# EAGLE design MCS8749R9 (EAGLE 4.16)
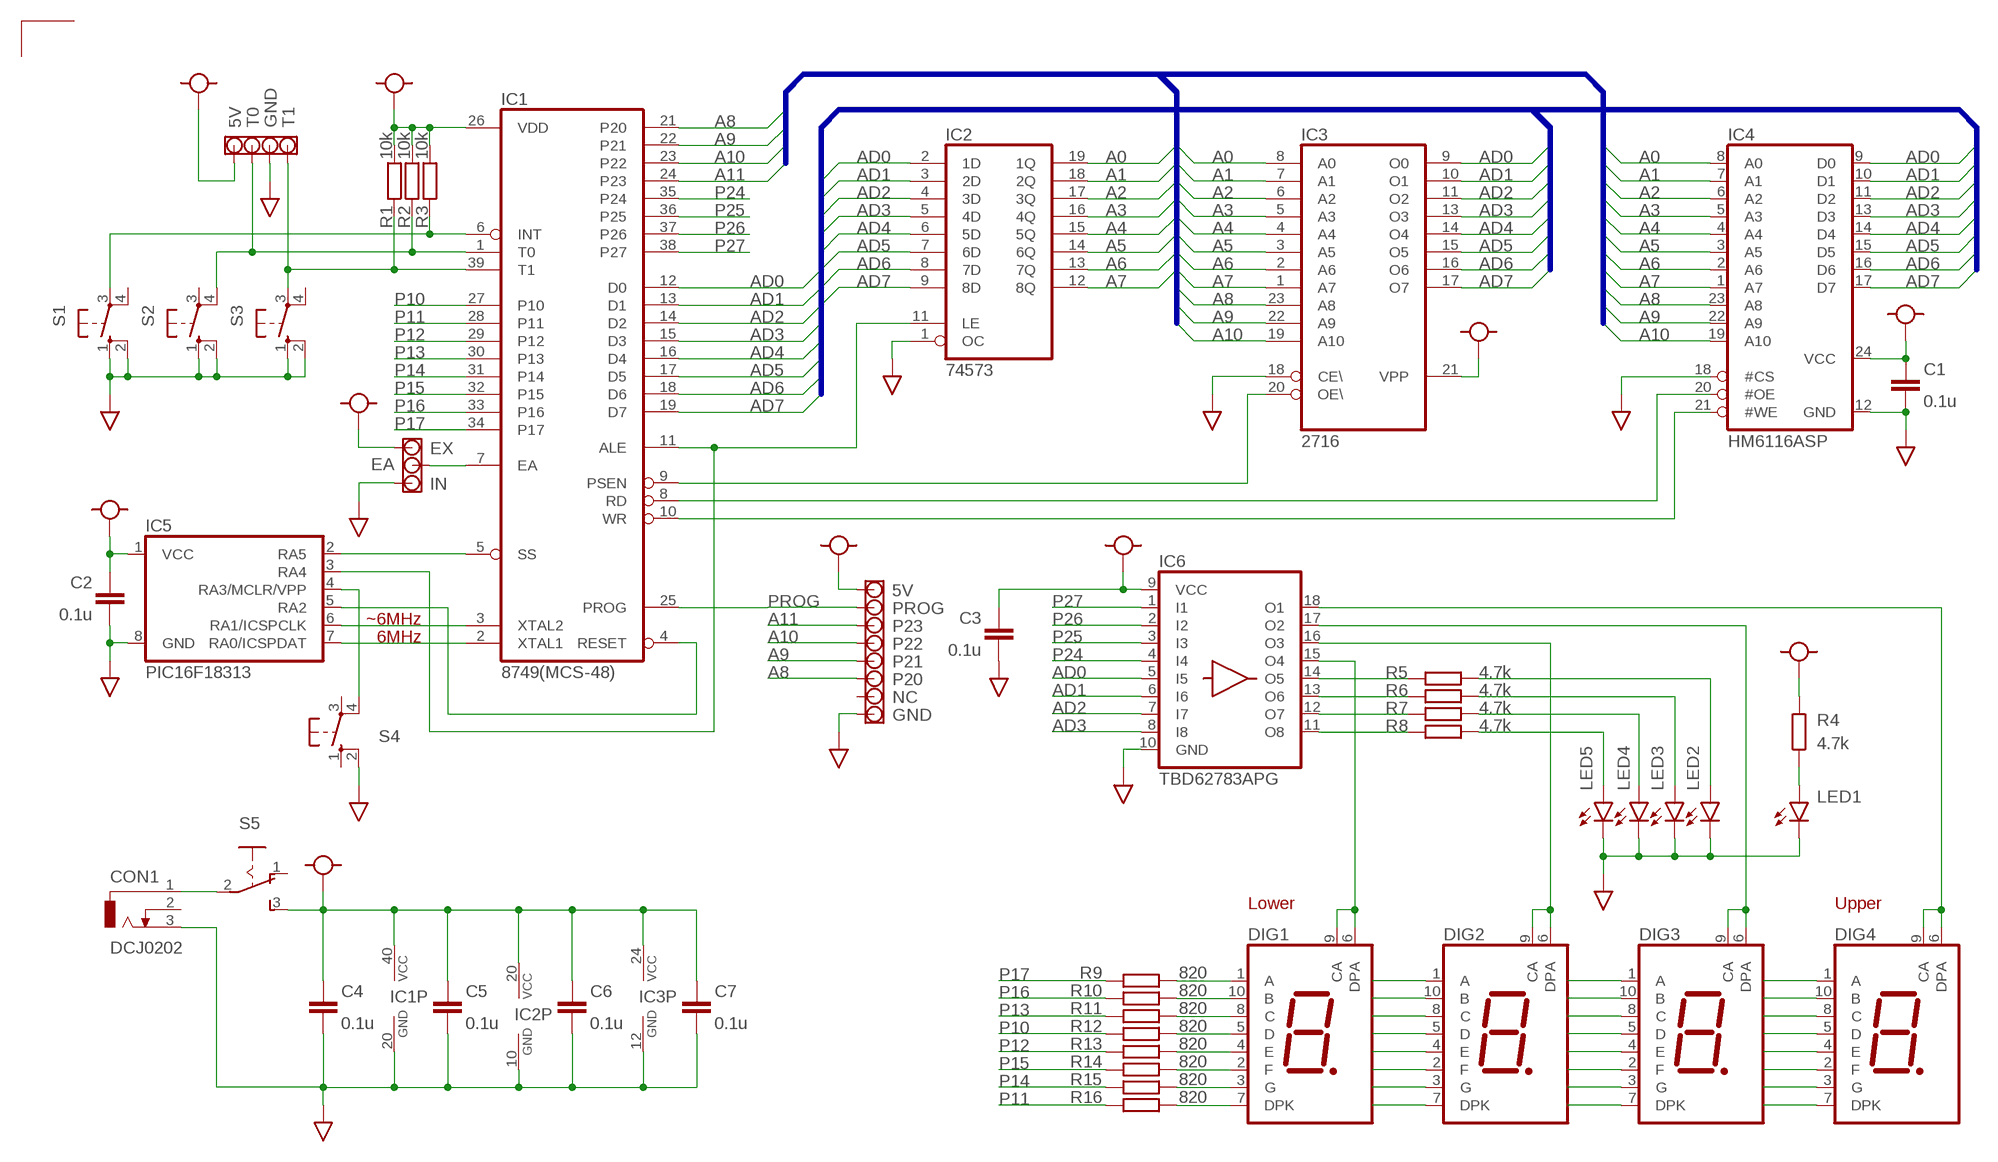
[diagram p0: schematic, sheet 1]

## Parts
C1  0.1u  C-CERAMIC  [C025-025X050]
C2  0.1u  C-CERAMIC  [C025-025X050]
C3  0.1u  C-CERAMIC  [C025-025X050]
C4  0.1u  C-CERAMIC  [C025-025X050]
C5  0.1u  C-CERAMIC  [C025-025X050]
C6  0.1u  C-CERAMIC  [C025-025X050]
C7  0.1u  C-CERAMIC  [C025-025X050]
CON1  DCJ0202  [DCJ0202]
DIG1  OSL10326IX  [OSL10326]
DIG2  OSL10326IX  [OSL10326]
DIG3  OSL10326IX  [OSL10326]
DIG4  OSL10326IX  [OSL10326]
IC1  8749(MCS-48)  8749  [DIL40]
IC2  74573  [DIL20]
IC3  2716  [DIL24]
IC4  HM6116ASP  6116ASP  [DIL24-3]
IC5  PIC16F18313  [DIL08]
IC6  TBD62783APG  TD62783APG  [DIL18]
LED1  OSX5212411  [OSX5212411]
LED2  OSX5212411  [OSX5212411]
LED3  OSX5212411  [OSX5212411]
LED4  OSX5212411  [OSX5212411]
LED5  OSX5212411  [OSX5212411]
R1  10k  R1/8W  [0207/10]
R2  10k  R1/8W  [0207/10]
R3  10k  R1/8W  [0207/10]
R4  4.7k  R1/8W  [0207/10]
R5  4.7k  R1/8W  [0207/10]
R6  4.7k  R1/8W  [0207/10]
R7  4.7k  R1/8W  [0207/10]
R8  4.7k  R1/8W  [0207/10]
R9  820  R1/8W  [0207/10]
R10  820  R1/8W  [0207/10]
R11  820  R1/8W  [0207/10]
R12  820  R1/8W  [0207/10]
R13  820  R1/8W  [0207/10]
R14  820  R1/8W  [0207/10]
R15  820  R1/8W  [0207/10]
R16  820  R1/8W  [0207/10]
S1  SW-TACT  [B3F-10XX]
S2  SW-TACT  [B3F-10XX]
S3  SW-TACT  [B3F-10XX]
S4  SW-TACT  [B3F-10XX]
S5  255SB  [255SB]
U$1  5V  LAND-NN  [LAND-NN]
U$2  T0  LAND-NN  [LAND-NN]
U$3  GND  LAND-NN  [LAND-NN]
U$4  T1  LAND-NN  [LAND-NN]
U$5  EX  LAND-NN  [LAND-NN]
U$6  EA  LAND-NN  [LAND-NN]
U$7  IN  LAND-NN  [LAND-NN]
U$8  5V  LAND-NN  [LAND-NN]
U$9  P20  LAND-NN  [LAND-NN]
U$10  P21  LAND-NN  [LAND-NN]
U$11  P22  LAND-NN  [LAND-NN]
U$12  P23  LAND-NN  [LAND-NN]
U$13  PROG  LAND-NN  [LAND-NN]
U$14  NC  LAND-NN  [LAND-NN]
U$15  GND  LAND-NN  [LAND-NN]

## Nets
A0: IC2.19(1Q) IC3.8(A0) IC4.8(A0)
A1: IC2.18(2Q) IC3.7(A1) IC4.7(A1)
A2: IC2.17(3Q) IC3.6(A2) IC4.6(A2)
A3: IC2.16(4Q) IC3.5(A3) IC4.5(A3)
A4: IC2.15(5Q) IC3.4(A4) IC4.4(A4)
A5: IC2.14(6Q) IC3.3(A5) IC4.3(A5)
A6: IC2.13(7Q) IC3.2(A6) IC4.2(A6)
A7: IC2.12(8Q) IC3.1(A7) IC4.1(A7)
A8: IC1.21(P20) IC3.23(A8) IC4.23(A8) U$9.P
A9: IC1.22(P21) IC3.22(A9) IC4.22(A9) U$10.P
A10: IC1.23(P22) IC3.19(A10) IC4.19(A10) U$11.P
A11: IC1.24(P23) U$12.P
AD0: IC1.12(D0) IC2.2(1D) IC3.9(O0) IC4.9(D0) IC6.5(I5)
AD1: IC1.13(D1) IC2.3(2D) IC3.10(O1) IC4.10(D1) IC6.6(I6)
AD2: IC1.14(D2) IC2.4(3D) IC3.11(O2) IC4.11(D2) IC6.7(I7)
AD3: IC1.15(D3) IC2.5(4D) IC3.13(O3) IC4.13(D3) IC6.8(I8)
AD4: IC1.16(D4) IC2.6(5D) IC3.14(O4) IC4.14(D4)
AD5: IC1.17(D5) IC2.7(6D) IC3.15(O5) IC4.15(D5)
AD6: IC1.18(D6) IC2.8(7D) IC3.16(O6) IC4.16(D6)
AD7: IC1.19(D7) IC2.9(8D) IC3.17(O7) IC4.17(D7)
ALE: IC1.11(ALE) IC2.11(LE) IC5.3(RA4)
GND: C1.2 C2.2 C3.2 C4.2 C5.2 C6.2 C7.2 CON1.3 IC1.20(GND) IC2.1(OC) IC2.10(GND) IC3.12(GND) IC3.18(CE\) IC4.12(GND) IC4.18(#CS) IC5.8(GND) IC6.10(GND) LED1.K(C) LED2.K(C) LED3.K(C) LED4.K(C) LED5.K(C) S1.1(S) S1.2(S1) S2.1(S) S2.2(S1) S3.1(S) S3.2(S1) S4.2(S1) U$3.P U$7.P U$15.P
INT: IC1.6(INT) R3.1 S1.3(P)
N$1: LED1.A R4.1
N$2: DIG4.6(DPA) DIG4.9(CA) IC6.18(O1)
N$4: DIG3.6(DPA) DIG3.9(CA) IC6.17(O2)
N$5: DIG2.6(DPA) DIG2.9(CA) IC6.16(O3)
N$6: DIG1.6(DPA) DIG1.9(CA) IC6.15(O4)
N$8: CON1.1 S5.2(P)
N$11: IC6.11(O8) R8.2
N$13: IC1.7(EA) U$6.P
N$17: IC6.12(O7) R7.2
N$18: IC6.13(O6) R6.2
N$19: IC6.14(O5) R5.2
N$20: LED5.A R8.1
N$21: LED4.A R7.1
N$23: LED2.A R5.1
N$24: LED3.A R6.1
P10: IC1.27(P10) R12.1
P11: IC1.28(P11) R16.1
P12: IC1.29(P12) R13.1
P13: IC1.30(P13) R11.1
P14: IC1.31(P14) R15.1
P15: IC1.32(P15) R14.1
P16: IC1.33(P16) R10.1
P17: IC1.34(P17) R9.1
P24: IC1.35(P24) IC6.4(I4)
P25: IC1.36(P25) IC6.3(I3)
P26: IC1.37(P26) IC6.2(I2)
P27: IC1.38(P27) IC6.1(I1)
PROG: IC1.25(PROG) U$13.P
PSEN: IC1.9(PSEN) IC3.20(OE\)
RA0: IC1.2(XTAL1) IC5.7(RA0/ICSPDAT)
RA1: IC1.3(XTAL2) IC5.6(RA1/ICSPCLK)
RA2: IC1.4(RESET) IC5.5(RA2)
RA3: IC5.4(RA3/MCLR/VPP) S4.4(P1)
RD: IC1.8(RD) IC4.20(#OE)
SEGA: DIG1.1(A) DIG2.1(A) DIG3.1(A) DIG4.1(A) R9.2
SEGB: DIG1.10(B) DIG2.10(B) DIG3.10(B) DIG4.10(B) R10.2
SEGC: DIG1.8(C) DIG2.8(C) DIG3.8(C) DIG4.8(C) R11.2
SEGD: DIG1.5(D) DIG2.5(D) DIG3.5(D) DIG4.5(D) R12.2
SEGDP: DIG1.7(DPK) DIG2.7(DPK) DIG3.7(DPK) DIG4.7(DPK) R16.2
SEGE: DIG1.4(E) DIG2.4(E) DIG3.4(E) DIG4.4(E) R13.2
SEGF: DIG1.2(F) DIG2.2(F) DIG3.2(F) DIG4.2(F) R14.2
SEGG: DIG1.3(G) DIG2.3(G) DIG3.3(G) DIG4.3(G) R15.2
SS: IC1.5(SS) IC5.2(RA5)
T0: IC1.1(T0) R2.1 S2.4(P1) U$2.P
T1: IC1.39(T1) R1.1 S3.3(P) U$4.P
VCC [Vcc]: C1.1 C2.1 C3.1 C4.1 C5.1 C6.1 C7.1 IC1.26(VDD) IC1.40(VCC) IC2.20(VCC) IC3.21(VPP) IC3.24(VCC) IC4.24(VCC) IC5.1(VCC) IC6.9(VCC) R1.2 R2.2 R3.2 R4.2 S5.3(S) U$1.P U$5.P U$8.P
WR: IC1.10(WR) IC4.21(#WE)
Unconnected: CON1.2 S1.4(P1) S2.3(P) S3.4(P1) S4.1(S) S4.3(P) S5.1(O) U$14.P

## Buses
AD[0..7]
A[0..10]

## Notes on the sheet
- ~6MHz
- 6MHz
- Lower | Upper

## Library data of the parts
C1-C7 = olimex-devices:C-CERAMIC: Ceramic Conenser
CON1 = olimex-devices:DCJ0202: DC POWER JACK Source: DCJ0202.pdf
DIG1-DIG4 = olimex-devices:OSL10326IX
IC1 = olimex-devices:8749: Intel Single Tip CPU
IC2 = olimex-devices:74573
IC3 = olimex-devices:2716: MEMORY UVEPROM 2Kbit x 8
IC4 = olimex-devices:6116ASP
IC5 = olimex-devices:PIC16F18313
IC6 = olimex-devices:TD62783APG
LED1-LED5 = olimex-devices:OSX5212411
R1-R16 = olimex-devices:R1/8W: Carbon Resistor
S1-S4 = olimex-devices:SW-TACT: Tact Switch (Small)
S5 = olimex-devices:255SB: SLIDING SWITCH distributor Buerklin, 11G810
U$1-U$15 = olimex-devices:LAND-NN

## Net classes
1 AC: width 0.762 mm
2 Vcc: width 0.508 mm

## Board
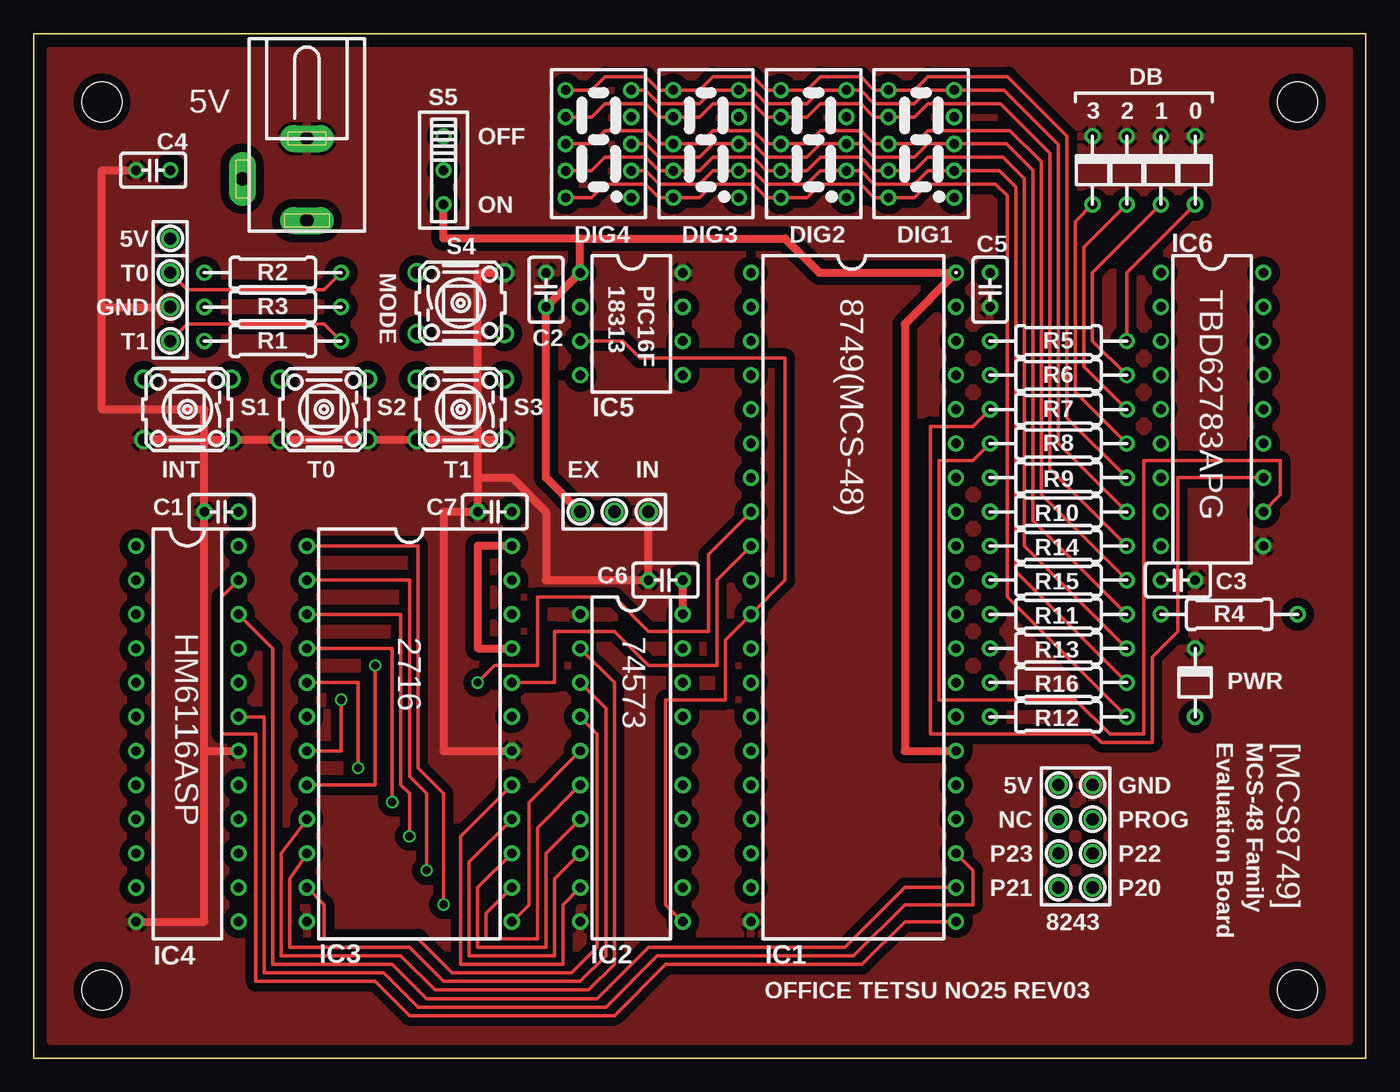
[diagram p1: board, top side]
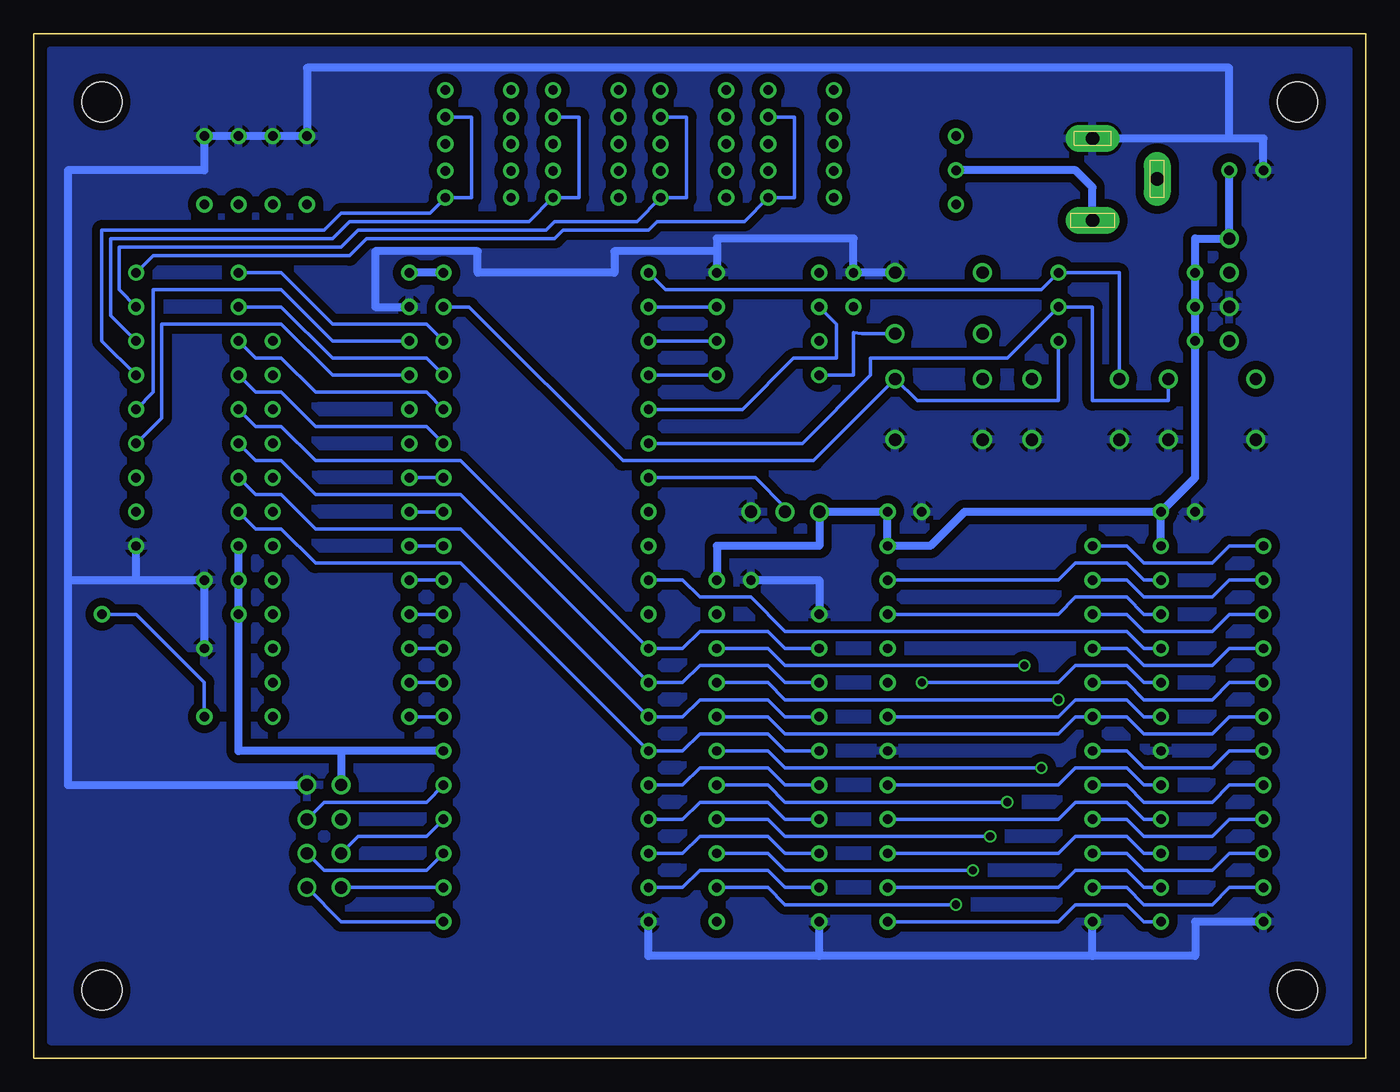
[diagram p2: board, bottom side, seen from below]

Size 99.06 x 76.2 mm. Coordinates in mm from the lower left corner, seen from the top.
Outline: 99.06,76.2 0,76.2 0,0 99.06,0 99.06,76.2
Copper layers (1*16): Top 0.035mm / dielectric 1.5mm / Bottom 0.035mm
Design rules "SeeedStudio": minimum track width 6mil, minimum drill 12mil, track to track 6mil, track to pad 6mil, pad to pad 6mil, via to via 6mil, smd to smd 0mil, copper to edge 10mil, drill to drill 10mil, minimum pad ring 10mil, minimum via ring 6mil, stop-mask expansion 2mil, vias tented up to drill 25mil, thermal gap 10mil
Holes 3 mm at 5.08,71.12 5.08,5.08 93.98,5.08 93.98,71.12

### Footprints (pad centres in the part's own frame; a part is rotated, then mirrored left to right if it is on the bottom)
C025-025X050 = drill 0.7 round: 1 -1.27,0; 2 1.27,0
DCJ0202 = drill 1 pad 2 long: 1 0,3.1; 2 4.8,0; 3 0,-3
OSL10326 = drill 0.7 round: 1 -2.44,4; 2 -2.44,2; 3 -2.44,0; 4 -2.44,-2; 5 -2.44,-4; 6 2.44,-4; 7 2.44,-2; 8 2.44,0; 9 2.44,2; 10 2.44,4
DIL40 = drill 0.7 round: 1 -24.13,-7.62; 2 -21.59,-7.62; 3 -19.05,-7.62; 4 -16.51,-7.62; 5 -13.97,-7.62; 6 -11.43,-7.62; 7 -8.89,-7.62; 8 -6.35,-7.62; 9 -3.81,-7.62; 10 -1.27,-7.62; 11 1.27,-7.62; 12 3.81,-7.62; 13 6.35,-7.62; 14 8.89,-7.62; 15 11.43,-7.62; 16 13.97,-7.62; 17 16.51,-7.62; 18 19.05,-7.62; 19 21.59,-7.62; 20 24.13,-7.62; 21 24.13,7.62; 22 21.59,7.62; 23 19.05,7.62; 24 16.51,7.62; 25 13.97,7.62; 26 11.43,7.62; 27 8.89,7.62; 28 6.35,7.62; 29 3.81,7.62; 30 1.27,7.62; 31 -1.27,7.62; 32 -3.81,7.62; 33 -6.35,7.62; 34 -8.89,7.62; 35 -11.43,7.62; 36 -13.97,7.62; 37 -16.51,7.62; 38 -19.05,7.62; 39 -21.59,7.62; 40 -24.13,7.62
DIL20 = drill 0.7 round: 1 -11.43,-3.81; 2 -8.89,-3.81; 3 -6.35,-3.81; 4 -3.81,-3.81; 5 -1.27,-3.81; 6 1.27,-3.81; 7 3.81,-3.81; 8 6.35,-3.81; 9 8.89,-3.81; 10 11.43,-3.81; 11 11.43,3.81; 12 8.89,3.81; 13 6.35,3.81; 14 3.81,3.81; 15 1.27,3.81; 16 -1.27,3.81; 17 -3.81,3.81; 18 -6.35,3.81; 19 -8.89,3.81; 20 -11.43,3.81
DIL24 = drill 0.7 round: 1 -13.97,-7.62; 2 -11.43,-7.62; 3 -8.89,-7.62; 4 -6.35,-7.62; 5 -3.81,-7.62; 6 -1.27,-7.62; 7 1.27,-7.62; 8 3.81,-7.62; 9 6.35,-7.62; 10 8.89,-7.62; 11 11.43,-7.62; 12 13.97,-7.62; 13 13.97,7.62; 14 11.43,7.62; 15 8.89,7.62; 16 6.35,7.62; 17 3.81,7.62; 18 1.27,7.62; 19 -1.27,7.62; 20 -3.81,7.62; 21 -6.35,7.62; 22 -8.89,7.62; 23 -11.43,7.62; 24 -13.97,7.62
DIL24-3 = drill 0.7 round: 1 -12.7,-3.81; 2 -10.16,-3.81; 3 -7.62,-3.81; 4 -5.08,-3.81; 5 -2.54,-3.81; 6 0,-3.81; 7 2.54,-3.81; 8 5.08,-3.81; 9 7.62,-3.81; 10 10.16,-3.81; 11 12.7,-3.81; 12 15.24,-3.81; 13 15.24,3.81; 14 12.7,3.81; 15 10.16,3.81; 16 7.62,3.81; 17 5.08,3.81; 18 2.54,3.81; 19 0,3.81; 20 -2.54,3.81; 21 -5.08,3.81; 22 -7.62,3.81; 23 -10.16,3.81; 24 -12.7,3.81
DIL08 = drill 0.7 round: 1 -3.81,-3.81; 2 -1.27,-3.81; 3 1.27,-3.81; 4 3.81,-3.81; 5 3.81,3.81; 6 1.27,3.81; 7 -1.27,3.81; 8 -3.81,3.81
DIL18 = drill 0.7 round: 1 -10.16,-3.81; 2 -7.62,-3.81; 3 -5.08,-3.81; 4 -2.54,-3.81; 5 0,-3.81; 6 2.54,-3.81; 7 5.08,-3.81; 8 7.62,-3.81; 9 10.16,-3.81; 10 10.16,3.81; 11 7.62,3.81; 12 5.08,3.81; 13 2.54,3.81; 14 0,3.81; 15 -2.54,3.81; 16 -5.08,3.81; 17 -7.62,3.81; 18 -10.16,3.81
OSX5212411 = drill 0.7 round: A -2.54,0; K 2.54,0
0207/10 = drill 0.7 round: 1 -5.08,0; 2 5.08,0
B3F-10XX = drill 0.9 round: 1 -3.251,2.261; 2 3.251,2.261; 3 -3.251,-2.261; 4 3.251,-2.261
255SB = drill 0.7 round: 1 -2.54,0; 2 0,0; 3 2.54,0
LAND-NN = drill 0.9 round: P 0,0

### Placement (x,y rotation side)
C1  13.97,40.64 180 top
C2  38.1,57.15 90 top
C3  85.09,35.56 0 top
C4  8.89,66.04 180 top
C5  71.12,57.15 270 top
C6  46.99,35.56 180 top
C7  34.29,40.64 180 top
CON1  20.32,65.41 180 top
DIG1  66,68 0 top
DIG2  58,68 0 top
DIG3  50,68 0 top
DIG4  42,68 0 top
IC1  60.96,34.29 270 top
IC2  44.45,21.59 270 top
IC3  27.94,24.13 270 top
IC4  11.43,25.4 270 top
IC5  44.45,54.61 270 top
IC6  87.63,48.26 270 top
LED1  86.36,27.94 90 top
LED2  86.36,66.04 90 top
LED3  83.82,66.04 90 top
LED4  81.28,66.04 90 top
LED5  78.74,66.04 90 top
R1  17.78,53.34 180 top
R2  17.78,58.42 180 top
R3  17.78,55.88 180 top
R4  88.9,33.02 180 top
R5  76.2,53.34 180 top
R6  76.2,50.8 180 top
R7  76.2,48.26 180 top
R8  76.2,45.72 180 top
R9  76.2,43.18 0 top
R10  76.2,40.64 0 top
R11  76.2,33.02 0 top
R12  76.2,25.4 0 top
R13  76.2,30.48 0 top
R14  76.2,38.1 0 top
R15  76.2,35.56 0 top
R16  76.2,27.94 0 top
S1  11.43,48.26 180 top
S2  21.59,48.26 180 top
S3  31.75,48.26 180 top
S4  31.75,56.16 0 top
S5  30.48,66.04 270 top
U$1  10.16,60.96 180 top
U$2  10.16,58.42 180 top
U$3  10.16,55.88 180 top
U$4  10.16,53.34 180 top
U$5  40.64,40.64 270 top
U$6  43.18,40.64 90 top
U$7  45.72,40.64 270 top
U$8  76.2,20.32 180 top
U$9  78.74,12.7 0 top
U$10  76.2,12.7 180 top
U$11  78.74,15.24 0 top
U$12  76.2,15.24 180 top
U$13  78.74,17.78 0 top
U$14  76.2,17.78 180 top
U$15  78.74,20.32 0 top

### Tracks (layer width: path | path; a pad name or v marks a point on that pad's centre or on a via)
A0  (via drill 0.6)
  Top 0.254: v25.4,29.21 25.4,20.32 IC3.8
  Bottom 0.254: IC4.8 10.16,20.32 11.43,19.05 16.51,19.05 17.78,20.32 IC3.8 | IC2.19 44.45,30.48 43.18,29.21 v25.4,29.21
A1  (via drill 0.6)
  Top 0.254: v22.86,26.67 22.86,22.86 IC3.7
  Bottom 0.254: IC4.7 10.16,22.86 11.43,21.59 16.51,21.59 17.78,22.86 IC3.7 | IC2.18 44.45,27.94 43.18,26.67 v22.86,26.67
A2
  Bottom 0.254: IC4.6 10.16,25.4 11.43,24.13 16.51,24.13 17.78,25.4 IC3.6 21.59,25.4 22.86,24.13 43.18,24.13 44.45,25.4 IC2.17
A3  (via drill 0.6)
  Top 0.254: v24.13,21.59 24.13,27.94 IC3.5
  Bottom 0.254: IC4.5 10.16,27.94 11.43,26.67 16.51,26.67 17.78,27.94 IC3.5 | IC2.16 44.45,22.86 43.18,21.59 v24.13,21.59
A4  (via drill 0.6)
  Top 0.254: v26.67,19.05 26.67,30.48 IC3.4
  Bottom 0.254: IC4.4 10.16,30.48 11.43,29.21 16.51,29.21 17.78,30.48 IC3.4 | IC2.15 44.45,20.32 43.18,19.05 v26.67,19.05
A5  (via drill 0.6)
  Top 0.254: v27.94,16.51 27.94,19.68 27.3,20.32 27.3,33.02 IC3.3
  Bottom 0.254: IC4.3 10.16,33.02 11.43,31.75 16.51,31.75 17.78,33.02 IC3.3 | IC2.14 44.45,17.78 43.18,16.51 v27.94,16.51
A6  (via drill 0.6)
  Top 0.254: v29.21,13.97 29.21,19.68 27.94,20.95 27.94,35.56 IC3.2
  Bottom 0.254: IC4.2 10.16,35.56 11.43,34.29 16.51,34.29 17.78,35.56 IC3.2 | IC2.13 44.45,15.24 43.18,13.97 v29.21,13.97
A7  (via drill 0.6)
  Top 0.254: v30.48,11.43 30.48,19.68 28.57,21.59 28.57,38.1 IC3.1
  Bottom 0.254: IC4.1 10.16,38.1 11.43,36.83 16.51,36.83 17.78,38.1 IC3.1 | IC2.12 44.45,12.7 43.18,11.43 v30.48,11.43
A8
  Top 0.254: IC1.21 64.77,10.16 61.59,6.99 46.99,6.99 43.18,3.17 27.94,3.17 25.4,5.71 16.51,5.71 16.51,24.13 13.97,24.13 13.97,34.29 IC4.23
  Bottom 0.254: IC4.23 16.51,35.56 17.78,36.83 21.59,36.83 22.86,35.56 IC3.23 | IC1.21 76.2,10.16 U$9.P
A9
  Top 0.254: IC1.22 64.77,12.7 60.33,8.26 45.72,8.26 41.91,4.45 29.21,4.45 26.67,6.99 17.78,6.99 17.78,30.48 IC4.22
  Bottom 0.254: IC4.22 16.51,33.02 17.78,34.29 21.59,34.29 22.86,33.02 IC3.22 | IC1.22 U$10.P
A10
  Top 0.254: IC1.23 69.85,13.97 69.85,11.43 64.77,11.43 60.96,7.62 46.35,7.62 42.55,3.81 28.57,3.81 26.04,6.35 17.14,6.35 17.14,25.4 IC4.19
  Bottom 0.254: IC4.19 16.51,25.4 17.78,26.67 21.59,26.67 22.86,25.4 IC3.19 | U$11.P 77.47,13.97 69.85,13.97 IC1.23
A11
  Bottom 0.254: IC1.24 69.85,16.51 74.93,16.51 U$12.P
AD0
  Top 0.254: IC3.9 18.41,15.24 18.41,7.62 27.3,7.62 29.84,5.08 41.27,5.08 43.18,6.99 43.18,27.94 IC2.2
  Bottom 0.254: IC4.9 10.16,17.78 11.43,16.51 16.51,16.51 17.78,17.78 IC3.9 | IC2.2 43.18,30.48 44.45,31.75 49.53,31.75 50.8,30.48 IC1.12 67.31,44.45 78.11,44.45 80.64,46.99 82.55,46.99 IC6.5
AD1
  Top 0.254: IC3.10 19.05,13.34 19.05,8.26 27.94,8.26 30.48,5.71 40.64,5.71 42.55,7.62 42.55,26.04 IC2.3
  Bottom 0.254: IC4.10 10.16,15.24 11.43,13.97 16.51,13.97 17.78,15.24 IC3.10 | IC2.3 43.18,27.94 44.45,29.21 49.53,29.21 50.8,27.94 IC1.13 67.31,41.91 78.11,41.91 80.64,44.45 82.55,44.45 IC6.6
AD2
  Top 0.254: IC3.11 21.59,11.43 21.59,8.89 28.57,8.89 31.11,6.35 40.01,6.35 41.91,8.26 41.91,24.13 IC2.4
  Bottom 0.254: IC4.11 10.16,12.7 11.43,11.43 16.51,11.43 17.78,12.7 IC3.11 | IC2.4 43.18,25.4 44.45,26.67 49.53,26.67 50.8,25.4 IC1.14 67.31,39.37 78.11,39.37 80.64,41.91 82.55,41.91 IC6.7
AD3
  Top 0.254: IC3.13 36.83,11.43 36.83,19.05 IC2.5
  Bottom 0.254: IC4.13 16.51,10.16 17.78,11.43 21.59,11.43 22.86,10.16 IC3.13 | IC2.5 43.18,22.86 44.45,24.13 49.53,24.13 50.8,22.86 IC1.15 67.31,36.83 78.11,36.83 80.64,39.37 82.55,39.37 IC6.8
AD4
  Top 0.254: IC3.14 33.66,10.79 33.66,8.89 37.47,8.89 37.47,17.14 IC2.6
  Bottom 0.254: IC4.14 16.51,12.7 17.78,13.97 21.59,13.97 22.86,12.7 IC3.14 | IC2.6 43.18,20.32 44.45,21.59 49.53,21.59 50.8,20.32 IC1.16
AD5
  Top 0.254: IC3.15 33.02,12.7 33.02,8.26 38.1,8.26 38.1,15.24 IC2.7
  Bottom 0.254: IC4.15 16.51,15.24 17.78,16.51 21.59,16.51 22.86,15.24 IC3.15 | IC2.7 43.18,17.78 44.45,19.05 49.53,19.05 50.8,17.78 IC1.17
AD6
  Top 0.254: IC3.16 32.38,14.61 32.38,7.62 38.73,7.62 38.73,13.34 IC2.8
  Bottom 0.254: IC4.16 16.51,17.78 17.78,19.05 21.59,19.05 22.86,17.78 IC3.16 | IC2.8 43.18,15.24 44.45,16.51 49.53,16.51 50.8,15.24 IC1.18
AD7
  Top 0.254: IC3.17 31.75,16.51 31.75,6.99 39.37,6.99 39.37,11.43 IC2.9
  Bottom 0.254: IC4.17 16.51,20.32 17.78,21.59 21.59,21.59 22.86,20.32 IC3.17 | IC2.9 43.18,12.7 44.45,13.97 49.53,13.97 50.8,12.7 IC1.19
ALE
  Top 0.254: IC2.11 46.99,11.43 46.99,26.67 51.44,26.67 51.44,31.11 IC1.11 55.88,35.56 55.88,52.07 45.09,52.07 43.81,53.34 IC5.3
GND
  Top 0.61: 12.7,22.86 12.7,10.16 IC4.12 | 12.7,22.86 C1.2 12.7,45.72 | 12.7,22.86 IC4.18 | 12.7,46 S1.2 | 33.02,46 S3.1 | 33.02,46 S3.2 | 33.02,46 33.02,45.72 | 33.02,45.72 33.02,43.18 | 33.02,43.18 C7.2 30.48,40.64 30.48,22.86 IC3.18 | 12.7,46 S1.1 S2.2 | 12.7,45.72 12.7,46 | S2.2 18.35,46 | S2.2 | S2.2 S2.1 S3.2 | S2.2 | S3.2 | S4.2 33.02,58.42 33.02,45.72 | 33.02,43.18 35.56,43.18 38.1,40.64 38.1,35.56 C6.2 U$7.P | 5.08,55.88 U$3.P | 5.08,55.88 5.08,48.26 12.7,48.26 12.7,45.72 | C4.2 5.08,66.04 5.08,55.88
  Bottom 0.61: IC4.12 12.7,10.16 12.7,7.62 20.32,7.62 | 20.32,7.62 40.64,7.62 | 40.64,7.62 53.34,7.62 IC1.20 | 40.64,7.62 IC2.10 | 20.32,7.62 IC3.12 | IC2.1 40.64,35.56 C6.2 | S4.2 C2.2 38.1,60.96 48.26,60.96 48.26,60.01 | 48.26,60.01 IC5.8 | C5.2 73.66,55.88 73.66,60.01 66.04,60.01 66.04,58.42 55.88,58.42 55.88,60.01 48.26,60.01 | 91.44,35.56 C3.2 LED1.K | 91.44,35.56 IC6.10 | 10.16,68.41 7.62,68.41 C4.2 | 10.16,68.41 CON1.3 | 10.16,68.41 10.16,73.66 78.74,73.66 LED5.K LED4.K LED3.K LED2.K 86.36,66.04 96.52,66.04 96.52,35.56 | 96.52,35.56 91.44,35.56 | U$15.P 96.52,20.32 96.52,35.56
  pour Bottom (isolate 0.61): 1.27,74.93 97.79,74.93 97.79,1.27 1.27,1.27
  pour Top (isolate 0.61): 1.27,74.93 97.79,74.93 97.79,1.27 1.27,1.27
INT
  Bottom 0.254: IC1.6 41.91,45.72 36.83,50.8 36.83,52.07 26.67,52.07 R3.1 20.32,55.88 20.32,48.9 14.68,48.9 S1.3
N$1
  Bottom 0.254: LED1.A 86.36,27.94 91.44,33.02 R4.1
N$2
  Bottom 0.254: DIG4.9 42.5,70 42.5,64 DIG4.6 46.21,62.23 52.7,62.23 53.34,61.59 59.69,61.59 60.33,60.96 74.3,60.96 75.56,59.69 90.17,59.69 IC6.18
N$4
  Bottom 0.254: DIG3.9 50.5,70 50.5,64 DIG3.6 54.21,62.23 60.33,62.23 60.96,61.59 74.93,61.59 76.2,60.33 92.71,60.33 92.71,57.15 IC6.17
N$5
  Bottom 0.254: DIG2.9 58.5,70 58.5,64 DIG2.6 60.46,64 62.23,62.23 75.56,62.23 76.83,60.96 93.34,60.96 93.34,55.24 IC6.16
N$6
  Bottom 0.254: DIG1.9 66.5,70 66.5,64 DIG1.6 69.58,62.87 76.2,62.87 77.47,61.59 93.98,61.59 93.98,53.34 IC6.15
N$8
  Bottom 0.61: S5.2 21.59,66.04 20.32,64.77 CON1.1
N$11
  Top 0.254: R8.2 69.85,44.45 67.31,44.45 67.31,26.67 77.47,26.67 80.01,24.13 82.55,24.13 82.55,44.45 92.71,44.45 92.71,41.91 IC6.11
N$13
  Bottom 0.254: U$6.P 43.18,40.96 45.4,43.18 IC1.7
N$17
  Top 0.254: R7.2 69.85,46.99 66.67,46.99 66.67,24.13 78.74,24.13 79.38,23.5 83.19,23.5 83.19,29.84 85.09,31.75 85.09,43.18 IC6.12
N$18
  Bottom 0.254: R6.2 76.83,50.8 80.64,54.61 89.53,54.61 89.53,47.62 IC6.13
N$19
  Bottom 0.254: R5.2 76.83,53.34 80.64,57.15 90.17,57.15 90.17,49.53 IC6.14
N$20
  Top 0.254: R8.1 77.47,49.53 77.47,62.23 LED5.A
N$21
  Top 0.254: R7.1 78.11,51.44 78.11,60.33 LED4.A
N$23
  Top 0.254: R5.1 81.28,58.42 LED2.A
N$24
  Top 0.254: R6.1 78.74,53.34 78.74,58.42 LED3.A
P10
  Bottom 0.254: IC1.27 R12.1
P11
  Bottom 0.254: IC1.28 R16.1
P12
  Bottom 0.254: IC1.29 R13.1
P13
  Bottom 0.254: IC1.30 R11.1
P14
  Bottom 0.254: IC1.31 R15.1
P15
  Bottom 0.254: IC1.32 R14.1
P16
  Bottom 0.254: IC1.33 R10.1
P17
  Bottom 0.254: IC1.34 R9.1
P24
  Bottom 0.254: IC1.35 69.85,46.99 78.11,46.99 80.64,49.53 82.55,49.53 IC6.4
P25
  Bottom 0.254: IC1.36 69.85,49.53 78.11,49.53 80.64,52.07 82.55,52.07 IC6.3
P26
  Bottom 0.254: IC1.37 69.85,52.07 76.83,52.07 80.64,55.88 IC6.2
P27
  Bottom 0.254: IC1.38 69.85,54.61 76.83,54.61 80.64,58.42 IC6.1
PROG
  Bottom 0.254: IC1.25 69.85,19.05 77.47,19.05 U$13.P
PSEN
  Top 0.254: IC3.20 38.73,27.94 38.73,31.75 43.18,31.75 45.72,29.21 50.8,29.21 50.8,35.56 IC1.9
RA0
  Bottom 0.254: IC5.7 IC1.2
RA1
  Bottom 0.254: IC5.6 IC1.3
RA2
  Bottom 0.254: IC5.5 IC1.4
RA3
  Bottom 0.254: S4.4 37.47,53.9 38.1,53.98 38.1,50.8 IC5.4
RD  (via drill 0.6)
  Top 0.254: IC1.8 50.16,37.47 50.16,31.75 45.72,31.75 43.18,34.29 37.47,34.29 37.47,29.21 34.29,29.21 v33.02,27.94
  Bottom 0.254: IC4.20 16.51,27.94 17.78,29.21 21.59,29.21 22.86,27.94 v33.02,27.94
SEGA
  Top 0.254: DIG4.1 41.5,72 42.5,73 45.5,73 46.5,72 DIG3.1 49.5,72 50.5,73 53.5,73 54.5,72 DIG2.1 57.5,72 58.5,73 61.5,73 62.5,72 DIG1.1 65.5,72 66.5,73 72.42,73 76.83,68.58 76.83,47.62 R9.2
SEGB
  Top 0.254: DIG4.10 45.5,72 46.5,71 49.5,71 50.5,72 DIG3.10 | DIG3.10 52.5,72 | DIG3.10 53.5,72 54.5,71 57.5,71 58.5,72 DIG2.10 | DIG2.10 60.5,72 | DIG2.10 61.5,72 62.5,71 65.5,71 66.5,72 DIG1.10 | DIG1.10 68.5,72 | R10.2 76.2,45.72 76.2,67.94 72.14,72 DIG1.10
SEGC
  Top 0.254: DIG4.8 45.5,68 46.5,67 49.5,67 50.5,68 DIG3.8 | DIG3.8 52.5,68 | DIG3.8 53.5,68 54.5,67 57.5,67 58.5,68 DIG2.8 | DIG2.8 60.5,68 | DIG2.8 61.5,68 62.5,67 65.5,67 66.5,68 DIG1.8 | DIG1.8 68.5,68 | R11.2 74.3,40.01 74.3,66.04 72.33,68 DIG1.8
SEGD
  Top 0.254: DIG4.5 41.5,64 42.5,65 45.5,65 46.5,64 DIG3.5 49.5,64 50.5,65 53.5,65 54.5,64 DIG2.5 57.5,64 58.5,65 61.5,65 62.5,64 DIG1.5 65.5,64 66.5,65 71.53,65 72.39,64.14 72.39,34.29 R12.2
SEGDP
  Top 0.254: DIG4.7 45.5,66 46.5,65 49.5,65 50.5,66 DIG3.7 | DIG3.7 52.5,66 | DIG3.7 53.5,66 54.5,65 57.5,65 58.5,66 DIG2.7 | DIG2.7 60.5,66 | DIG2.7 61.5,66 62.5,65 65.5,65 66.5,66 DIG1.7 | DIG1.7 68.5,66 | R16.2 73.03,36.2 73.03,64.77 71.8,66 DIG1.7
SEGE
  Top 0.254: DIG4.4 41.5,66 42.5,67 45.5,67 46.5,66 DIG3.4 49.5,66 50.5,67 53.5,67 54.5,66 DIG2.4 57.5,66 58.5,67 61.5,67 62.5,66 DIG1.4 65.5,66 66.5,67 72.06,67 73.66,65.41 73.66,38.1 R13.2
SEGF
  Top 0.254: DIG4.2 41.5,70 42.5,71 45.5,71 46.5,70 DIG3.2 49.5,70 50.5,71 53.5,71 54.5,70 DIG2.2 57.5,70 58.5,71 61.5,71 62.5,70 DIG1.2 65.5,70 66.5,71 71.88,71 75.56,67.31 75.56,43.81 R14.2
SEGG
  Top 0.254: DIG4.3 41.5,68 42.5,69 45.5,69 46.5,68 DIG3.3 49.5,68 50.5,69 53.5,69 54.5,68 DIG2.3 57.5,68 58.5,69 61.5,69 62.5,68 DIG1.3 65.5,68 66.5,69 72.61,69 74.93,66.67 74.93,41.91 R15.2
SS
  Bottom 0.254: IC5.2 39.37,54.61 39.37,52.07 42.55,52.07 46.35,48.26 IC1.5
T0
  Top 0.254: U$2.P 11.43,57.15 21.59,57.15 R2.1
  Bottom 0.254: IC1.1 52.07,57.15 24.13,57.15 R2.1 18.34,58.42 S2.4
T1
  Top 0.254: U$4.P 11.43,54.61 21.59,54.61 R1.1
  Bottom 0.254: IC1.39 66.67,55.88 55.24,44.45 41.07,44.45 S3.3 34.96,50.52 33.34,48.9 22.86,48.9 R1.1
VCC
  Top 0.61: C6.1 IC2.20 | IC3.24 33.02,38.1 33.02,30.48 IC3.21 | U$5.P 38.1,43.18 C2.1 IC5.1 40.64,60.96 | 40.64,60.96 55.88,60.96 58.42,58.42 IC1.40 64.77,54.61 64.77,22.86 IC1.26 | S5.3 30.48,60.96 40.64,60.96
  Bottom 0.61: IC1.40 C5.1 | IC4.24 C1.1 | C1.1 29.84,40.64 32.38,38.1 IC3.24 C7.1 U$5.P 40.64,38.1 48.26,38.1 C6.1 | C1.1 12.7,43.18 R1.2 R3.2 R2.2 12.7,60.96 U$1.P C4.1 | IC1.26 76.2,22.86 | IC6.9 C3.1 R4.2 83.82,22.86 76.2,22.86 | 76.2,22.86 U$8.P
WR
  Bottom 0.254: IC4.21 16.51,30.48 17.78,31.75 43.18,31.75 45.72,34.29 49.53,34.29 50.8,35.56 IC1.10

### Text on the board
tPlace: 5V | DB | 3 | 2 | 1 | 0 | OFF | ON | MODE | 18313 | PIC16F | INT | T0 | T1 | EX | IN | PWR | Evaluation Board | MCS-48 Family | [MCS8749] | 8243 | OFFICE TETSU NO25 REV03